# Altium schematic sheet JammerCon_v1.1.SchDoc
size 584 x 381 mm
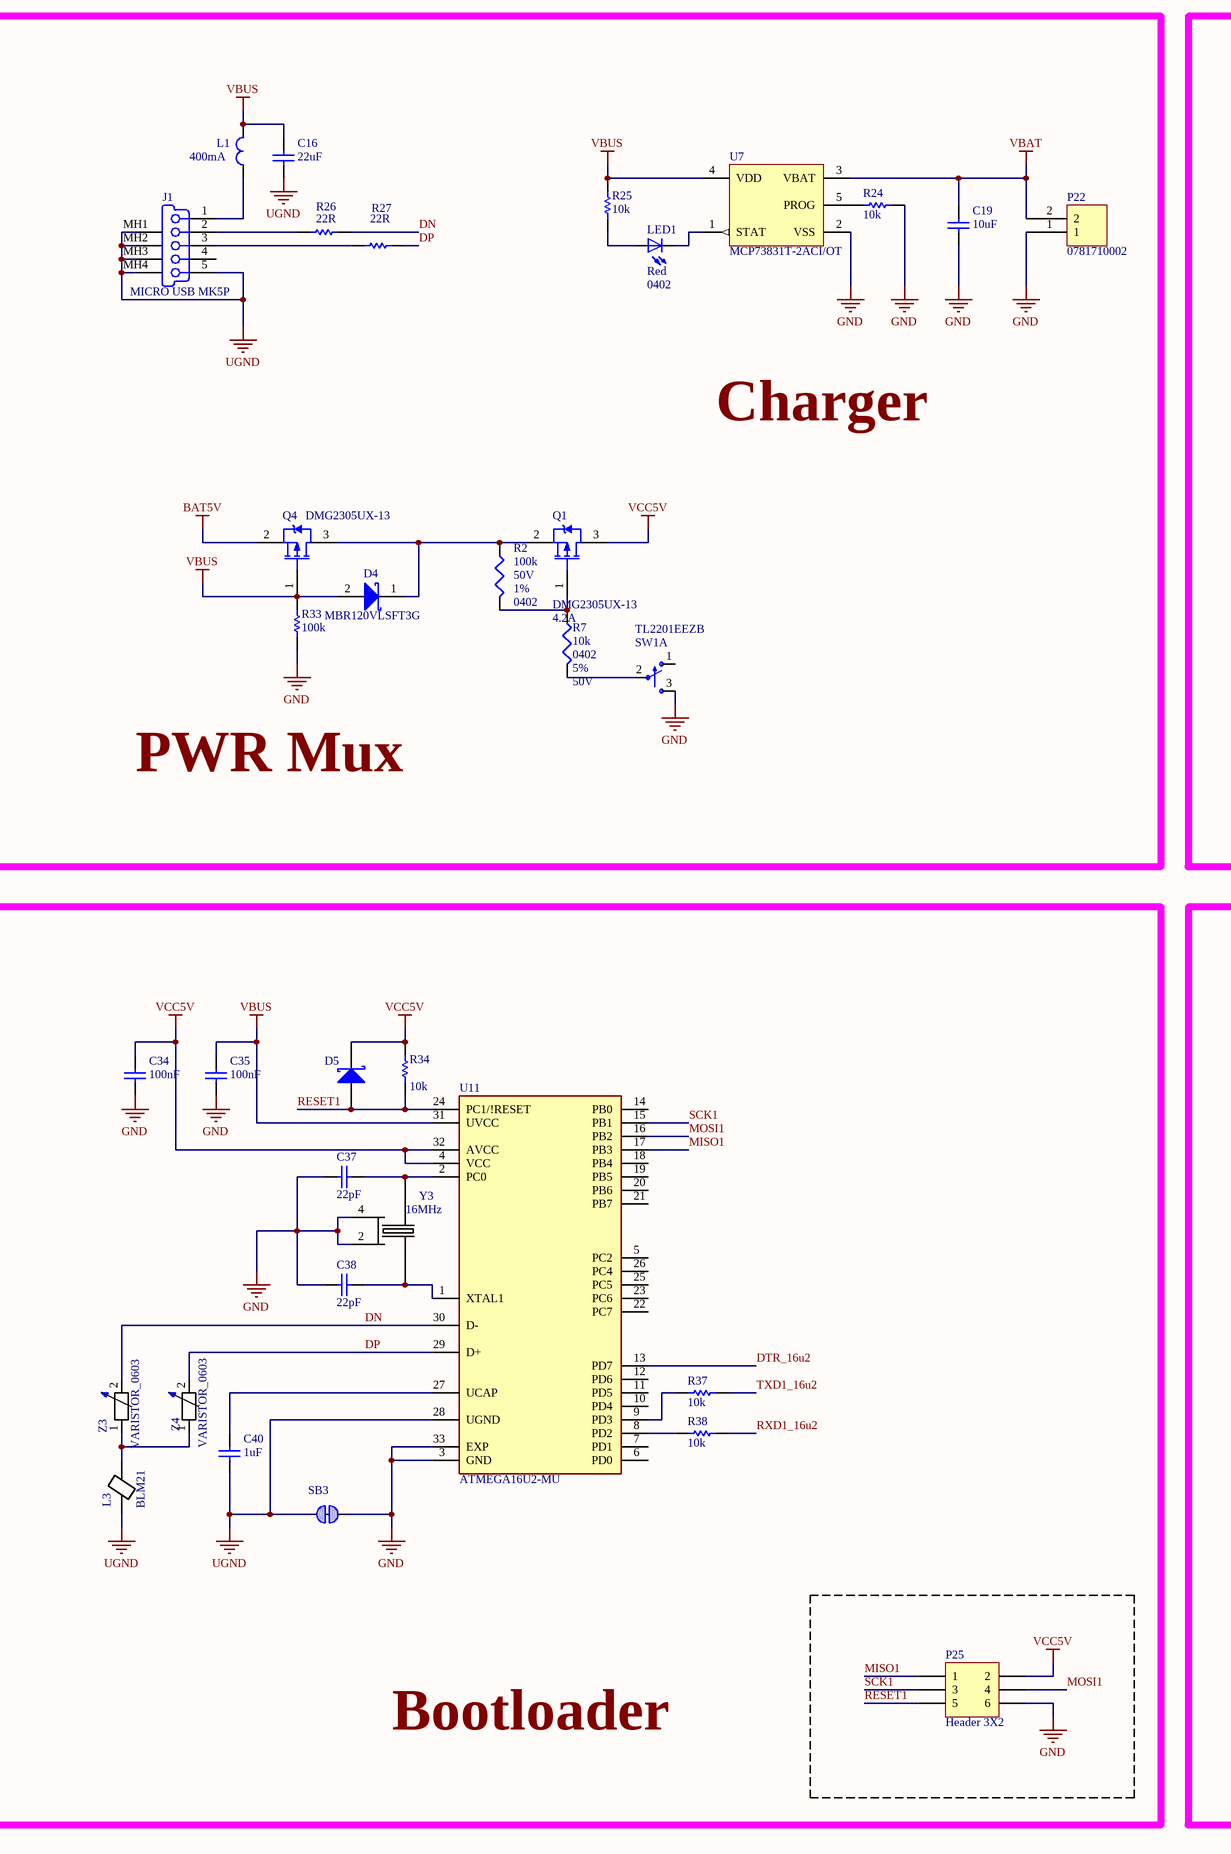
[diagram p0: JammerCon_v1.1.SchDoc, left]
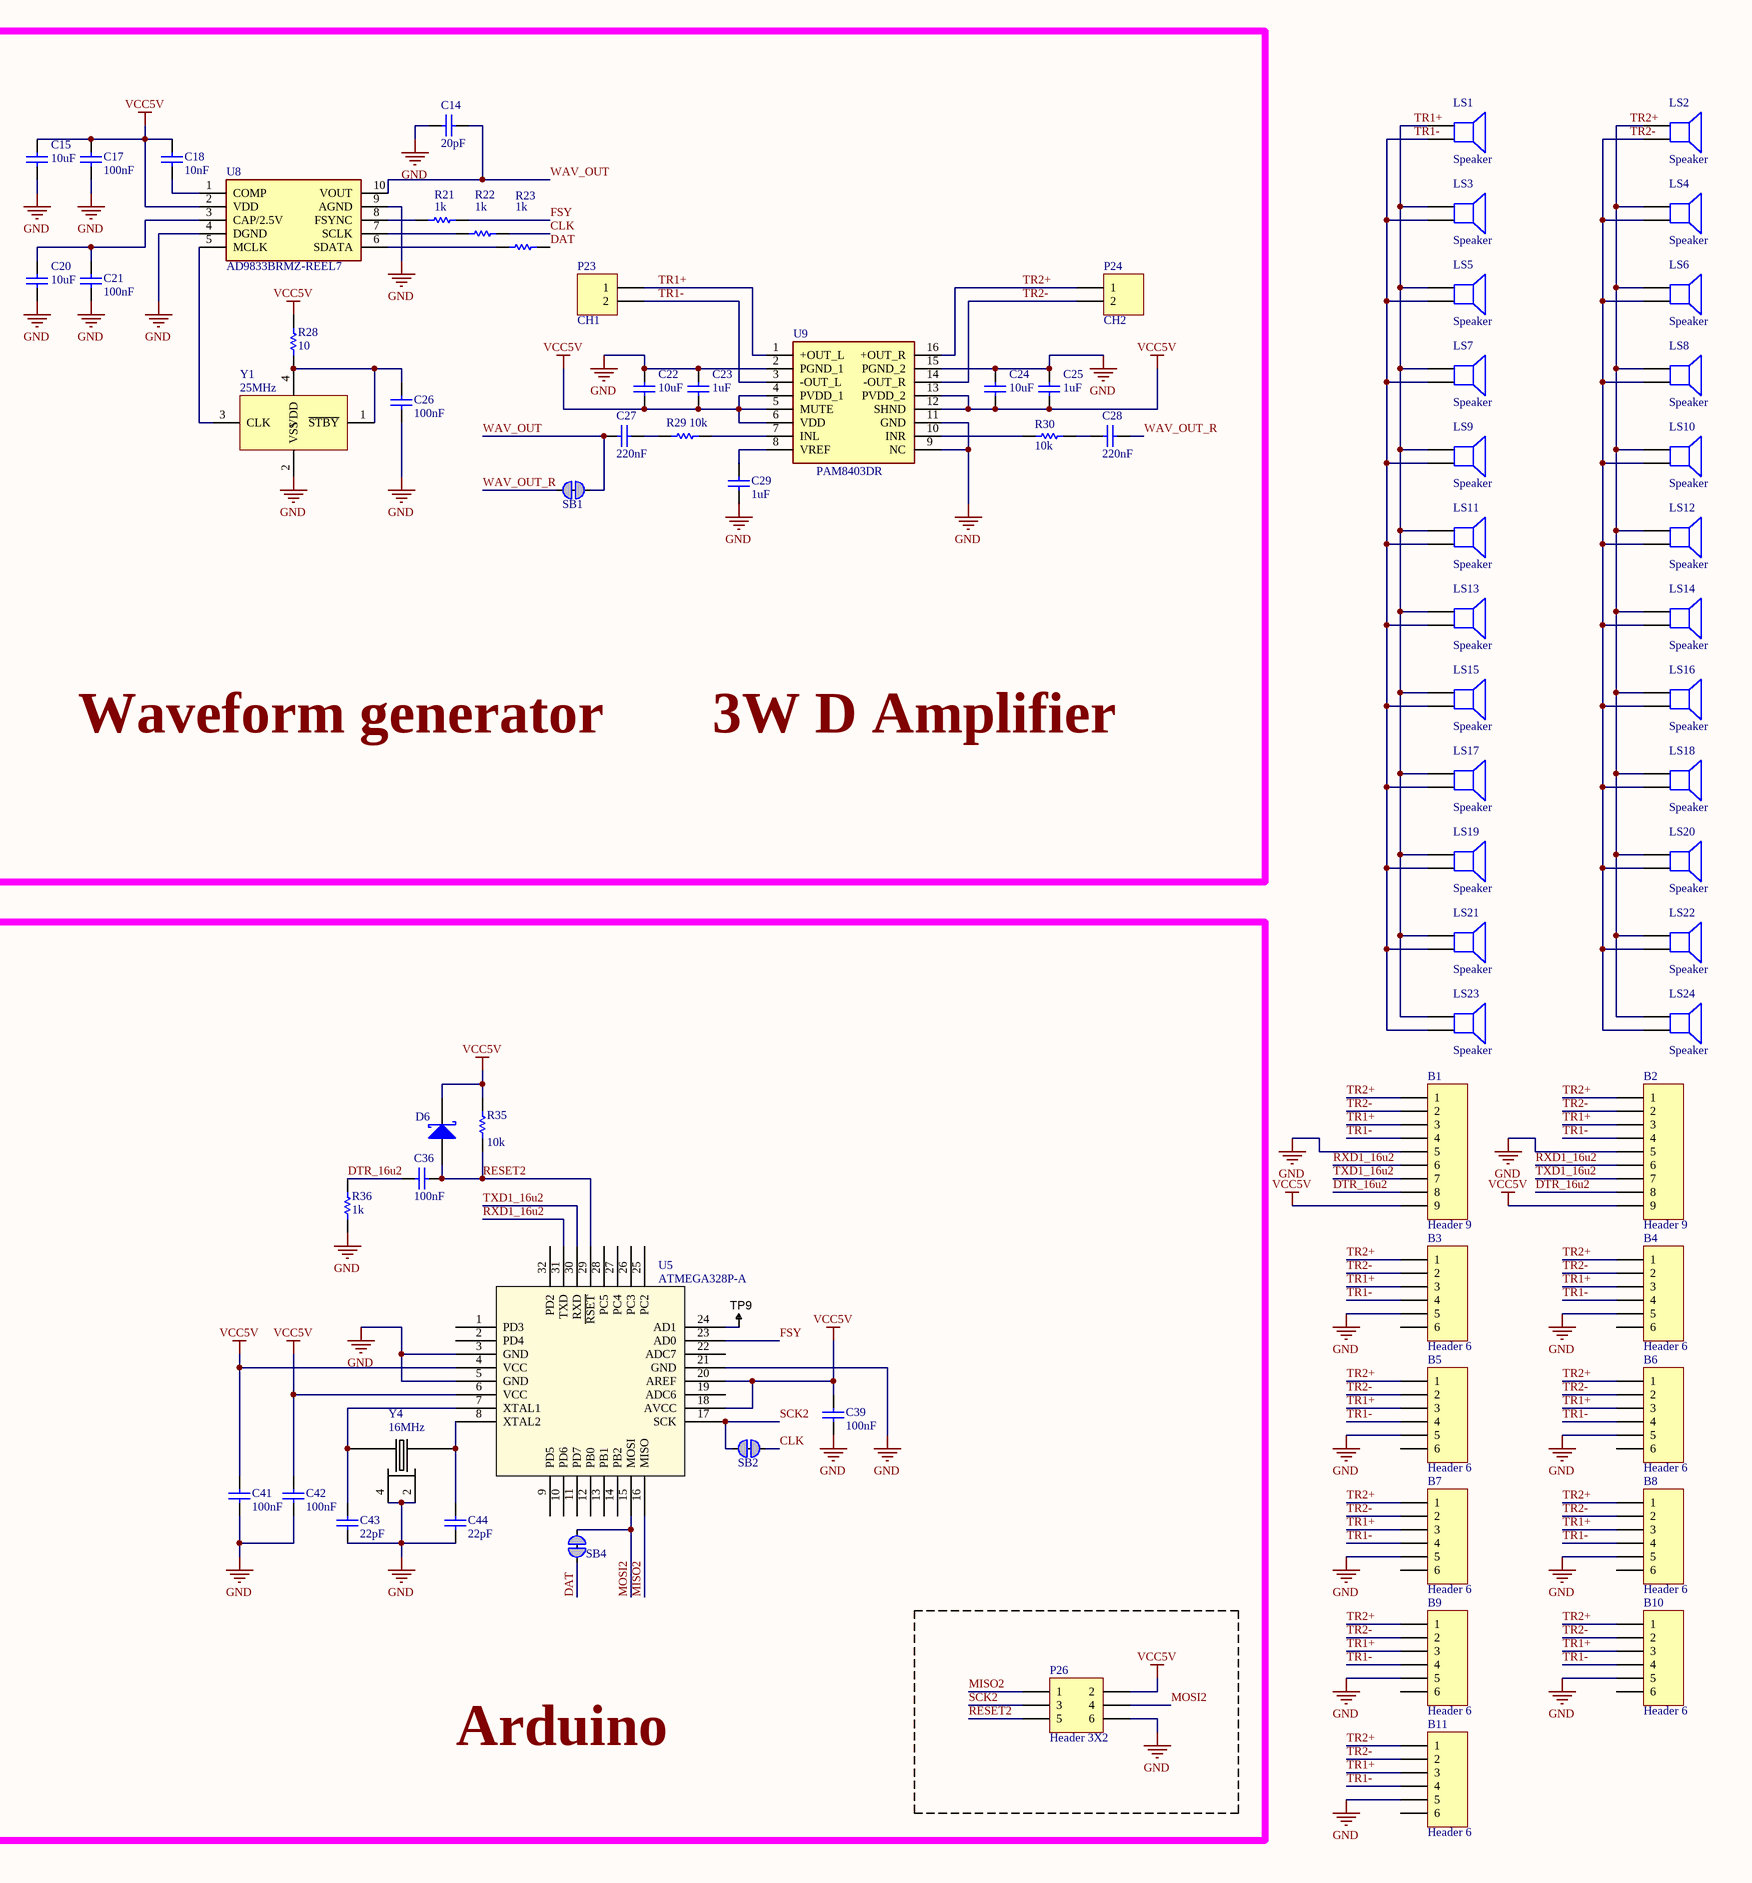
[diagram p1: JammerCon_v1.1.SchDoc, right]

## Parts
B1  Header 9  [HDR1X9]
B2  Header 9  [HDR1X9]
B3  Header 6  [HDR1X6]
B4  Header 6  [HDR1X6]
B5  Header 6  [HDR1X6]
B6  Header 6  [HDR1X6]
B7  Header 6  [HDR1X6]
B8  Header 6  [HDR1X6]
B9  Header 6  [HDR1X6]
B10  Header 6  [HDR1X6]
B11  Header 6  [HDR1X6]
C14  value 20pF  [C0402]  (hidden comment: Cap Semi)
C15  value 10uF  [C0805]  (hidden comment: Cap Semi)
C16  value 22uF  [C0603]  (hidden comment: Cap Semi)
C17  value 100nF  [R0402]  (hidden comment: Cap Semi)
C18  value 10nF  [R0402]  (hidden comment: Cap Semi)
C19  value 10uF  [C0402]  (hidden comment: Cap Semi)
C20  value 10uF  [C0805]  (hidden comment: Cap Semi)
C21  value 100nF  [R0402]  (hidden comment: Cap Semi)
C22  value 10uF  [C0603]  (hidden comment: Cap Semi)
C23  value 1uF  [C0603]  (hidden comment: Cap Semi)
C24  value 10uF  [C0603]  (hidden comment: Cap Semi)
C25  value 1uF  [C0603]  (hidden comment: Cap Semi)
C26  value 100nF  [R0402]  (hidden comment: Cap Semi)
C27  value 220nF  [C0603]  (hidden comment: Cap Semi)
C28  value 220nF  [C0603]  (hidden comment: Cap Semi)
C29  value 1uF  [R0402]  (hidden comment: Cap Semi)
C34  value 100nF  [C0201]  (hidden comment: Cap Semi)
C35  value 100nF  [C0201]  (hidden comment: Cap Semi)
C36  value 100nF  [R0402]  (hidden comment: Cap Semi)
C37  value 22pF  [C0402]  (hidden comment: Cap Semi)
C38  value 22pF  [C0402]  (hidden comment: Cap Semi)
C39  value 100nF  [R0402]  (hidden comment: Cap Semi)
C40  value 1uF  [C0402]  (hidden comment: Cap Semi)
C41  value 100nF  [R0402]  (hidden comment: Cap Semi)
C42  value 100nF  [R0402]  (hidden comment: Cap Semi)
C43  value 22pF  [C0402]  (hidden comment: Cap Semi)
C44  value 22pF  [C0402]  (hidden comment: Cap Semi)
D4  MBR120VLSFT3G  [SOD-123FL]
D5  ZENER 5.6V  [SOD-323]  (value not drawn)
D6  ZENER 5.6V  [SOD-323]  (value not drawn)
J1  MICRO USB MK5P  [1050170001]
L1  Max DC Current: 400mA  [L0603]  (hidden comment: BMB2A0430RS2)
L3  BLM21  [*BEADC2012X87N]
LED1  Color: Red  Case/Package: 0402  [LED-0402-RED]
LS1  Speaker  [ULTRASONICSENSOR]
LS2  Speaker  [ULTRASONICSENSOR]
LS3  Speaker  [ULTRASONICSENSOR]
LS4  Speaker  [ULTRASONICSENSOR]
LS5  Speaker  [ULTRASONICSENSOR]
LS6  Speaker  [ULTRASONICSENSOR]
LS7  Speaker  [ULTRASONICSENSOR]
LS8  Speaker  [ULTRASONICSENSOR]
LS9  Speaker  [ULTRASONICSENSOR]
LS10  Speaker  [ULTRASONICSENSOR]
LS11  Speaker  [ULTRASONICSENSOR]
LS12  Speaker  [ULTRASONICSENSOR]
LS13  Speaker  [ULTRASONICSENSOR]
LS14  Speaker  [ULTRASONICSENSOR]
LS15  Speaker  [ULTRASONICSENSOR]
LS16  Speaker  [ULTRASONICSENSOR]
LS17  Speaker  [ULTRASONICSENSOR]
LS18  Speaker  [ULTRASONICSENSOR]
LS19  Speaker  [ULTRASONICSENSOR]
LS20  Speaker  [ULTRASONICSENSOR]
LS21  Speaker  [ULTRASONICSENSOR]
LS22  Speaker  [ULTRASONICSENSOR]
LS23  Speaker  [ULTRASONICSENSOR]
LS24  Speaker  [ULTRASONICSENSOR]
P22  Manufacturer Part Number: 0781710002  [CONN_MOLEX_781710002]  (hidden comment: SMT Battery connector)
P23  CH1  [HDR1X2]
P24  CH2  [HDR1X2]
P25  Header 3X2  [TC2030-MCP]
P26  Header 3X2  [TC2030-MCP]
Q1  DMG2305UX-13  Continuous Drain Current (ID): 4.2A  [SOT23-3]
Q4  (no value)  [SOT23-3]
R2  value 100k  Case/Package: 0402  Tolerance: 1%  Voltage Rating: 50V  [R0402]  (hidden comment: Res3)
R7  value 10k  Case/Package: 0402  Tolerance: 5%  Voltage Rating: 50V  [R0402]  (hidden comment: Res3)
R21  value 1k  [R0402]  (hidden comment: Res0402)
R22  value 1k  [R0402]  (hidden comment: Res0402)
R23  value 1k  [R0402]  (hidden comment: Res0402)
R24  value 10k  [R0402]  (hidden comment: Res0402)
R25  value 10k  [R0402]  (hidden comment: Res0402)
R26  value 22R  [R0402]  (hidden comment: Res0402)
R27  value 22R  [R0402]  (hidden comment: Res0402)
R28  value 10  [R0402]  (hidden comment: Res0402)
R29  value 10k  [R0603]  (hidden comment: Res0402)
R30  value 10k  [R0603]  (hidden comment: Res0402)
R33  value 100k  [R0402]  (hidden comment: Res0402)
R34  value 10k  [R0402]  (hidden comment: Res0402)
R35  value 10k  [R0402]  (hidden comment: Res0402)
R36  value 1k  [R0402]  (hidden comment: Res)
R37  value 10k  [R0201]  (hidden comment: Res0201)
R38  value 10k  [R0201]  (hidden comment: Res0201)
SB1  Solderbridge  [Solderbridge_Shorted]  (value not drawn)  (net tie, no BOM)
SB2  Solderbridge  [Solderbridge_Shorted]  (value not drawn)  (net tie, no BOM)
SB3  Solderbridge  [Solderbridge_Shorted]  (value not drawn)  (net tie, no BOM)
SB4  Solderbridge  [Solderbridge_Shorted]  (value not drawn)  (net tie, no BOM)
SW1  TL2201EEZB  [TL2201EEZB]  (part A of 2)
TP9  TESTPOINT  [TP-R60]  (value not drawn)  (no BOM)
U5  ATMEGA328P-A  [ATMEGA328P]
U7  MCP73831T-2ACI/OT  [SOT23-5]
U8  AD9833BRMZ-REEL7  [SOP50P490X110-10N]
U9  PAM8403DR  [SOIC127P605X175-16N]
U11  ATMEGA16U2-MU  [*QFN50P500X500X100-33N]
Y1  25MHz  [OSC_ECS-3951M-250-BN-TR]
Y3  16MHz  [BT-XTAL_2016_N]
Y4  16MHz  [BT-XTAL_2016_N]
Z3  VARISTOR_0603  [*R0603]
Z4  VARISTOR_0603  [*R0603]

## Nets
BAT5V: Q4.2(S)
GND: B1.5 B2.5 B3.5 B4.5 B5.5 B6.5 B7.5 B8.5 B9.5 B10.5 B11.5 C14.1 C15.1 C17.2 C19.1 C20.1 C21.2 C22.2 C23.2 C24.2 C25.2 C26.2 C29.2 C34.1 C35.1 C37.2 C38.2 C39.1 C41.1 C42.1 C43.2 C44.2 P22.1 P25.6 P26.6 R24.2 R33.1 R36.1 SB3.2 SW1.3(S) U5.3(GND) U5.5(GND) U5.21(GND) U7.2(VSS) U8.4(DGND) U8.9(AGND) U9.2(PGND_1) U9.9(NC) U9.11(GND) U9.15(PGND_2) U11.3(GND) U11.33(EXP) Y1.2(VSS) Y3.2 Y3.4 Y4.2 Y4.4
UGND: C16.1 C40.1 J1.5(GND) J1.MH1(Tab) J1.MH2(Tab) J1.MH3(Tab) J1.MH4(Tab) L3.1 SB3.1 U11.28(UGND)
VBAT: C19.2 P22.2 U7.3(VBAT)
VBUS: C16.2 C35.2 D4.2(K) L1.2 Q4.1(G) R25.2 R33.2 U7.4(VDD) U11.31(UVCC)
VCC5V: B1.9 B2.9 C15.2 C17.1 C18.1 C22.1 C23.1 C24.1 C25.1 C34.2 C39.2 C41.2 C42.2 D5.2(K) D6.2(K) P25.2 P26.2 Q1.3(D) R28.1 R34.2 R35.2 U5.4(VCC) U5.6(VCC) U5.18(AVCC) U5.20(AREF) U8.2(VDD) U9.4(PVDD_1) U9.5(MUTE) U9.6(VDD) U9.12(SHND) U9.13(PVDD_2) U11.4(VCC) U11.32(AVCC)
CLK: R22.1 SB2.2
DAT: R23.1 SB4.2
DN: R26.1 U11.30(D-) Z3.2
DP: R27.1 U11.29(D+) Z4.2
DTR_16u2: B1.8 B2.8 C36.2 R36.2 U11.13(PD7)
FSY: R21.1 U5.23(AD0)
MISO1: P25.1 U11.17(PB3)
MISO2: P26.1 U5.16(MISO)
MOSI1: P25.4 U11.16(PB2)
MOSI2: P26.4 SB4.1 U5.15(MOSI)
RESET1: D5.1(A) P25.5 R34.1 U11.24(PC1/!RESET)
RESET2: C36.1 D6.1(A) P26.5 R35.1 U5.29(~{RSET})
RXD1_16u2: B1.6 B2.6 R38.2 U5.31(TXD)
SCK1: P25.3 U11.15(PB1)
SCK2: P26.3 SB2.1 U5.17(SCK)
TR1+: B1.3 B2.3 B3.3 B4.3 B5.3 B6.3 B7.3 B8.3 B9.3 B10.3 B11.3 LS1.1 LS3.1 LS5.1 LS7.1 LS9.1 LS11.1 LS13.1 LS15.1 LS17.1 LS19.1 LS21.1 LS23.1 P23.1 U9.1(+OUT_L)
TR1-: B1.4 B2.4 B3.4 B4.4 B5.4 B6.4 B7.4 B8.4 B9.4 B10.4 B11.4 LS1.2 LS3.2 LS5.2 LS7.2 LS9.2 LS11.2 LS13.2 LS15.2 LS17.2 LS19.2 LS21.2 LS23.2 P23.2 U9.3(-OUT_L)
TR2+: B1.1 B2.1 B3.1 B4.1 B5.1 B6.1 B7.1 B8.1 B9.1 B10.1 B11.1 LS2.1 LS4.1 LS6.1 LS8.1 LS10.1 LS12.1 LS14.1 LS16.1 LS18.1 LS20.1 LS22.1 LS24.1 P24.1 U9.16(+OUT_R)
TR2-: B1.2 B2.2 B3.2 B4.2 B5.2 B6.2 B7.2 B8.2 B9.2 B10.2 B11.2 LS2.2 LS4.2 LS6.2 LS8.2 LS10.2 LS12.2 LS14.2 LS16.2 LS18.2 LS20.2 LS22.2 LS24.2 P24.2 U9.14(-OUT_R)
TXD1_16u2: B1.7 B2.7 R37.2 U5.30(RXD)
WAV_OUT: C14.2 C27.2 SB1.2 U8.10(VOUT)
WAV_OUT_R: C28.2 SB1.1
NetC18_2: C18.2 U8.1(COMP)
NetC20_2: C20.2 C21.1 U8.3(CAP/2.5V)
NetC26_1: C26.1 R28.2 Y1.1(~{STBY}) Y1.4(VDD)
NetC27_1: C27.1 R29.2
NetC28_1: C28.1 R30.2
NetC29_1: C29.1 U9.8(VREF)
NetC37_1: C37.1 U11.2(PC0) Y3.1
NetC38_1: C38.1 U11.1(XTAL1) Y3.3
NetC40_2: C40.2 U11.27(UCAP)
NetC43_1: C43.1 U5.7(XTAL1) Y4.1
NetC44_1: C44.1 U5.8(XTAL2) Y4.3
NetD4_1: D4.1(A) Q1.2(S) Q4.3(D) R2.1
NetJ1_1: J1.1(V_BUS_(5V)) L1.1
NetJ1_2: J1.2(D-) R26.2
NetJ1_3: J1.3(D+) R27.2
NetL3_2: L3.2 Z3.1 Z4.1
NetLED1_A: LED1.A R25.1
NetLED1_C: LED1.C U7.1(STAT)
NetQ1_1: Q1.1(G) R2.2 R7.1
NetR7_2: R7.2 SW1.2(P)
NetR21_2: R21.2 U8.8(FSYNC)
NetR22_2: R22.2 U8.7(SCLK)
NetR23_2: R23.2 U8.6(SDATA)
NetR24_1: R24.1 U7.5(PROG)
NetR29_1: R29.1 U9.7(INL)
NetR30_1: R30.1 U9.10(INR)
NetR37_1: R37.1 U11.9(PD3)
NetR38_1: R38.1 U11.8(PD2)
NetTP9_1: TP9.1 U5.24(AD1)
NetU8_5: U8.5(MCLK) Y1.3(CLK)

Not connected (* = marked no-connect by the designer): B3 6; B4 6; B5 6; B6 6; B7 6; B8 6; B9 6; B10 6; B11 6; J1 4(NC); SW1 1(O); U5 1(PD3) 2(PD4) 9(PD5) 10(PD6) 11(PD7) 12(PB0) 13(PB1) 14(PB2) 19(ADC6) 22(ADC7) 25(PC2) 26(PC3) 27(PC4) 28(PC5) 32(PD2); U11 5(PC2) 6(PD0) 7(PD1) 10(PD4) 11(PD5) 12(PD6) 14(PB0) 18(PB4) 19(PB5) 20(PB6) 21(PB7) 22(PC7) 23(PC6) 25(PC5) 26(PC4)

## Notes on the sheet
- Charger
- Waveform generator
- 3W D Amplifier
- PWR Mux
- Bootloader
- Arduino

## Library data of the parts
B1 B2 = Header 9: Header, 9-Pin; LatestRevisionDate: 17-Jul-2002; LatestRevisionNote: Re-released for DXP Platform.; Publisher: Altium Limited
B3-B11 = Header 6: Header, 6-Pin; LatestRevisionDate: 17-Jul-2002; LatestRevisionNote: Re-released for DXP Platform.; Publisher: Altium Limited
C14-C29 C34-C44 = Cap Semi: Capacitor (Semiconductor SIM Model)
D4 = D Schottky: Schottky Diodes & Rectifiers 1A 20V; Manufacturer: ON Semiconductor; Max Surge Current: 45A; Forward Voltage: 340mV; Max Reverse Current: 600uA; Element Configuration: Single; Polarity: Standard; Supplier 1: Digi-Key; Supplier Part Number 1: MBR120VLSFT3GOSCT-ND; Manufacturer Part Number: MBR120VLSFT3G; Stock 1: 9969; Pricing 1: 1=0.41, 10=0.317, 100=0.1903, 500=0.1762, 1000=0.1198, 2000=0.1103, 5000=0.1057 (USD); Number of Pins: 2; Min Operating Temperature: -65°C; Max Operating Temperature: 125°C; Package Quantity: 10000; Forward Current: 1A; Packaging: Tape and Reel; Max Reverse Leakage Current: 600uA; Average Rectified Current: 1A; Peak Non-Repetitive Surge Current: 45A; Max Repetitive Reverse Voltage (Vrrm): 20V; Max Forward Surge Current (Ifsm): 45A; Voltage Rating (DC): 20V; Current Rating: 1A; Output Current: 1A; Max Reverse Voltage (DC): 20V; Series: -; Radiation Hardening: No; REACH SVHC: No SVHC; Lead Free: Lead Free; Halogen Free: Halogen Free; RoHS Compliant: Yes; ComponentLink1URL: http://www.mouser.com/ds/2/308/MBR120VLSFT1-D-107081.pdf?src-supplier=Mouser; ComponentLink1Description: http://www.mouser.com/ds/2/308/MBR120VLSFT1-D-107081.pdf?src-supplier=Mouser; ComponentLink2URL: http://www.onsemi.com/pub/Collateral/MBR120VLSFT1-D.PDF?src-supplier=Digi-Key; ComponentLink2Description: http://www.onsemi.com/pub/Collateral/MBR120VLSFT1-D.PDF?src-supplier=Digi-Key; ComponentLink3URL: http://www.onsemi.cn/pub_link/Collateral/MBR120VLSFT1-D.PDF?src-supplier=Avnet; ComponentLink3Description: http://www.onsemi.cn/pub_link/Collateral/MBR120VLSFT1-D.PDF?src-supplier=Avnet
D5 D6 = Diode 18TQ045: Zener Diode 5.6V SOD-323F; Manufacturer: ON Semiconductor / Fairchild; Manufacturer Part Number: MM3Z5V6B; Value: 5.6V 200mW; Max Power Dissipation: 200mW; Forward Voltage: 1V; Tolerance: 2%; Impedance: 37R; Max Reverse Leakage Current: 900nA; Test Current: 5mA; Element Configuration: Single; Supplier 1: Digi-Key; Supplier Part Number 1: MM3Z5V6BDKR-ND; Stock 1: 198832; Pricing 1: 1=0.22, 10=0.18, 100=0.0956, 500=0.0629, 1000=0.0428 (USD); Mount: Surface Mount; Number of Pins: 2; Weight: 0.0276g; Min Operating Temperature: -65°C; Max Operating Temperature: 150°C; Packaging: Tape and Reel; Package Quantity: 1; Zener Voltage: 5.6V; Voltage Tolerance: 2%; Power Dissipation: 200mW; Working Voltage: 5.6V; Peak Reverse Current: 900nA; Length: 1.3mm; Height: 1mm; Width: 1.7mm; Radiation Hardening: No; REACH SVHC: No SVHC; Lead Free: Lead Free; ComponentLink1URL: http://www.fairchildsemi.com/ds/MM/MM3Z9V1B.pdf; ComponentLink1Description: http://www.fairchildsemi.com/ds/MM/MM3Z9V1B.pdf; ComponentLink2URL: http://www.onsemi.com/pub/Collateral/MM3Z9V1B-D.pdf; ComponentLink2Description: http://www.onsemi.com/pub/Collateral/MM3Z9V1B-D.pdf; ComponentLink3URL: http://www.mouser.com/ds/2/149/MM3Z5V6B-195782.pdf; ComponentLink3Description: http://www.mouser.com/ds/2/149/MM3Z5V6B-195782.pdf
J1 = USB_Mini_B: USB On-The-Go (OTG) Mini-B
L1 = BEAD: FERRITE BEAD INDUCTOR; Manufacturer: Taiyo Yuden; Manufacturer Part Number: BK1608HW431-T; Tolerance: 25%; Impedance: 430R; Resistance: 300mR; Number of Lines: 1; Test Frequency: 100MHz; Shielding: Shielded; Supplier 1: Digi-Key; Supplier Part Number 1: 587-1878-1-ND; Stock 1: 5299; Pricing 1: 1=0.1, 10=0.079, 25=0.072, 50=0.0648, 100=0.0476, 250=0.0346, 500=0.0317, 1000=0.0274 (USD); Mount: Surface Mount; Case/Package: 0603; Number of Pins: 2; Core Material: Ferrite; Case Code (Metric): 1608; Case Code (Imperial): 0603; Min Operating Temperature: -55°C; Max Operating Temperature: 125°C; Package Quantity: 1; Packaging: Tape and Reel; Max Current Rating: 400mA; DC Resistance (DCR): 300mR; Termination: SMD/SMT; Frequency: 100MHz; Length: 0.063inch; Height: 0.037inch; Width: 0.031inch; Depth: 0.95mm; REACH SVHC: No SVHC; Lead Free: Lead Free; Halogen Free: Halogen Free; ComponentLink1URL: http://ds.yuden.co.jp/TYCOMPAS/ut/detail.do?productNo=BK1608HW431-T&fileName=BK1608HW431-T_SS&mode=specSheetDownload&src-supplier=Digi-Key; ComponentLink1Description: http://ds.yuden.co.jp/TYCOMPAS/ut/detail.do?productNo=BK1608HW431-T&fileName=BK1608HW431-T_SS&mode=specSheetDownload&src-supplier=Digi-Key; ComponentLink2URL: http://www.yuden.co.jp/productdata/catalog/en/mlci07_e.pdf?src-supplier=Farnell; ComponentLink2Description: http://www.yuden.co.jp/productdata/catalog/en/mlci07_e.pdf?src-supplier=Farnell; ComponentLink3URL: http://www.farnell.com/datasheets/2083103.pdf?src-supplier=Element14; ComponentLink3Description: http://www.farnell.com/datasheets/2083103.pdf?src-supplier=Element14
L3 = BLM21PG331SN1D: Ferrite Beads Multi-Layer 330Ohm 25% 100MHz 1.5A 70mOhm DCR 0805 Paper T/R; MF: Murata; MP: BLM21PG331SN1D; SnapEDA_Link: https://www.snapeda.com/parts/BLM21PG331SN1D/Murata%20Electronics%20North%20America/view-part/?ref=snap; Availability: Unavailable; Package: 0805 Murata; Price: None; Value: *
LED1 = LED0402 red: Red LED 0402; Manufacturer: SunLED; Manufacturer Part Number: XZMDK68W-2; Lens Color: Colorless; Lens Transparency: Clear; Luminous Intensity: 69mcd; Test Current: 20mA; Viewing Angle: 120°; Dominant Wavelength: 630nm; Forward Voltage: 1.95V; Supplier 1: Digi-Key; Supplier Part Number 1: 1497-1174-1-ND; Stock 1: 195016; Pricing 1: 1=0.32, 10=0.249, 100=0.1117, 500=0.1009, 1000=0.0829 (USD); Mount: Surface Mount; Case Code (Metric): 1005; Case Code (Imperial): 0402; Packaging: Tape and Reel; Length: 1mm; Width: 0.5mm; Height: 0.6mm; RoHS Compliant: Yes; ComponentLink1URL: http://www.sunledusa.com/products/spec/XZMDK68W-2.pdf?src-supplier=Digi-Key; ComponentLink1Description: http://www.sunledusa.com/products/spec/XZMDK68W-2.pdf?src-supplier=Digi-Key; ComponentLink2URL: https://www.sunledusa.com/products/spec/XZMDK68W-2.pdf?src-supplier=Digi-Key; ComponentLink2Description: https://www.sunledusa.com/products/spec/XZMDK68W-2.pdf?src-supplier=Digi-Key
LS1-LS24 = Speaker: Loudspeaker
  LS2-LS24: Published: 24-Mar-1999; LatestRevisionDate: 17-Jul-2002; LatestRevisionNote: Re-released for DXP Platform.; PackageReference: PIN2; Publisher: Altium Limited
P22 = CONN_MOLEX_0781710002: 1.20MM WTB HEADER VERT 2POS; Manufacturer: Molex; Number of Positions: 2; Max Voltage Rating (DC): 50V; Contact Resistance: 20mR; Connector Type: Tab,Plug; Pitch: 1.2mm; Supplier 1: Digi-Key; Supplier Part Number 1: WM4459CT-ND; Stock 1: 35198; Pricing 1: 1=0.61, 10=0.567, 100=0.4349, 500=0.3782, 1000=0.312 (USD); Mount: Surface Mount; Housing Material: Polymer; Color: Black; Contact Plating: Gold; Contact Material: Copper Alloy; Housing Color: Black; Min Operating Temperature: -25°C; Max Operating Temperature: 85°C; Number of Rows: 1; Packaging: Tape and Reel; Termination: Solder; Orientation: Straight; Fastening Type: Friction; Max Voltage Rating (AC): 50V; Number of Contacts: 2; Length: 4.2mm; Depth: 4.5mm; Radiation Hardening: No; ComponentLink1URL: https://www.molex.com/pdm_docs/as/AS-78172-006-001.pdf?src-supplier=Digi-Key; ComponentLink1Description: https://www.molex.com/pdm_docs/as/AS-78172-006-001.pdf?src-supplier=Digi-Key; ComponentLink2URL: http://components.arrow.com/part/dataview/47501414S8822330N3303?src-supplier=Arrow; ComponentLink2Description: http://components.arrow.com/part/dataview/47501414S8822330N3303?src-supplier=Arrow; ComponentLink3URL: https://www.molex.com/pdm_docs/sd/781710002_sd.pdf?src-supplier=Digi-Key; ComponentLink3Description: https://www.molex.com/pdm_docs/sd/781710002_sd.pdf?src-supplier=Digi-Key; ComponentLink4URL: http://www.molex.com/webdocs/datasheets/pdf/en-us/0781710002_PCB_HEADERS.pdf?src-supplier=Avnet; ComponentLink4Description: http://www.molex.com/webdocs/datasheets/pdf/en-us/0781710002_PCB_HEADERS.pdf?src-supplier=Avnet
P23 P24 = Header 2: Header, 2-Pin; LatestRevisionDate: 17-Jul-2002; LatestRevisionNote: Re-released for DXP Platform.; Publisher: Altium Limited
P25 P26 = Header 3X2: Header, 3-Pin, Dual row
Q1 = ZXMP10A13FTA: MOSFET P-CH 20V 4.2A SOT23; Manufacturer: Diodes; Rise Time: 13.7ns; Rds On Max: 52mR; Input Capacitance: 808pF; Max Power Dissipation: 1.4W; Turn-On Delay Time: 10.8ns; Turn-Off Delay Time: 79.3ns; Fall Time: 34.7ns; Threshold Voltage: -900mV; Element Configuration: Single; Gate to Source Voltage (Vgs): 8V; Number of Channels: 1; Drain to Source Breakdown Voltage: -20V; On-State Resistance: 65MR; Supplier 1: Digi-Key; Supplier Part Number 1: DMG2305UX-13DICT-ND; Manufacturer Part Number: DMG2305UX-13; Stock 1: 562398; Pricing 1: 1=0.38, 10=0.348, 100=0.1948, 500=0.1044, 1000=0.071 (EUR); Mount: Surface Mount; Case/Package: SOT-23; Number of Pins: 3; Weight: 0.000282oz; Min Operating Temperature: -55°C; Max Operating Temperature: 150°C; Package Quantity: 1; Packaging: Tape and Reel; Drain to Source Voltage (Vdss): 20V; Drain to Source Resistance: 52mR; Length: 3mm; Height: 1.1mm; Width: 1.4mm; Radiation Hardening: No; REACH SVHC: No SVHC; Lead Free: Lead Free; ComponentLink1URL: http://www.diodes.com/datasheets/DMG2305UX.pdf; ComponentLink1Description: http://www.diodes.com/datasheets/DMG2305UX.pdf; ComponentLink2URL: https://www.diodes.com/assets/Datasheets/DMG2305UX.pdf; ComponentLink2Description: https://www.diodes.com/assets/Datasheets/DMG2305UX.pdf
Q4 = DMG2305UX-13: MOSFET P-CH 20V 4.2A SOT23; Manufacturer: Diodes; Rise Time: 13.7ns; Rds On Max: 52mR; Input Capacitance: 808pF; Max Power Dissipation: 1.4W; Turn-On Delay Time: 10.8ns; Turn-Off Delay Time: 79.3ns; Fall Time: 34.7ns; Threshold Voltage: -900mV; Element Configuration: Single; Gate to Source Voltage (Vgs): 8V; Number of Channels: 1; Drain to Source Breakdown Voltage: -20V; On-State Resistance: 65MR; Supplier 1: Digi-Key; Supplier Part Number 1: DMG2305UX-13DICT-ND; Manufacturer Part Number: DMG2305UX-13; Stock 1: 1009768; Pricing 1: 1=0.37, 10=0.253, 25=0.2528, 100=0.1236, 500=0.1031, 1000=0.0717, 2500=0.0621, 5000=0.059 (USD); Mount: Surface Mount; Case/Package: SOT-23; Number of Pins: 3; Weight: 0.000282oz; Min Operating Temperature: -55°C; Max Operating Temperature: 150°C; Package Quantity: 1; Packaging: Tape and Reel; Continuous Drain Current (ID): 4.2A; Drain to Source Voltage (Vdss): 20V; Drain to Source Resistance: 52mR; Length: 3mm; Width: 1.4mm; Height: 1.1mm; Radiation Hardening: No; REACH SVHC: No SVHC; Lead Free: Lead Free; RoHS Compliant: Yes; ComponentLink1URL: http://www.diodes.com/datasheets/DMG2305UX.pdf?src-supplier=Avnet; ComponentLink1Description: http://www.diodes.com/datasheets/DMG2305UX.pdf?src-supplier=Avnet; ComponentLink2URL: https://www.diodes.com/assets/Datasheets/DMG2305UX.pdf?src-supplier=Digi-Key; ComponentLink2Description: https://www.diodes.com/assets/Datasheets/DMG2305UX.pdf?src-supplier=Digi-Key; ComponentLink3URL: http://www.diodes.com/datasheets/DMG2305UX.pdf?src-supplier=Future+Electronics; ComponentLink3Description: http://www.diodes.com/datasheets/DMG2305UX.pdf?src-supplier=Future+Electronics
R2 = Res3: Resistor; Manufacturer: Yageo; Manufacturer Part Number: RC0402FR-07100KL; Resistance: 100kR; Temperature Coefficient: 100ppm/°C; Power Rating: 63mW; Supplier 1: Digi-Key; Supplier Part Number 1: 311-100KLRCT-ND; Stock 1: 62177550; Pricing 1: 1=0.1, 10=0.016, 100=0.0067, 1000=0.003, 2500=0.0026, 5000=0.0022 (USD); Case Code (Metric): 1005; Case Code (Imperial): 0402; Min Operating Temperature: -55°C; Max Operating Temperature: 155°C; Packaging: Tape and Reel; Composition: Thick Film; Termination: SMD/SMT; Military Standard: Not; Number of Terminations: 2; Working Voltage: 50V; Package Quantity: 1; Max Power Dissipation: 63mW; Features: Moisture Resistant; Length: 0.039inch; Height: 0.016inch; Width: 0.02inch; Depth: 0.5mm; REACH SVHC: No SVHC; Lead Free: Lead Free; ComponentLink1URL: http://www.yageo.com/documents/recent/PYu-RC_Group_51_RoHS_L_10.pdf?src-supplier=Digi-Key; ComponentLink1Description: http://www.yageo.com/documents/recent/PYu-RC_Group_51_RoHS_L_10.pdf?src-supplier=Digi-Key; ComponentLink2URL: http://www.farnell.com/datasheets/1018594.pdf?src-supplier=Element14; ComponentLink2Description: http://www.farnell.com/datasheets/1018594.pdf?src-supplier=Element14; ComponentLink3URL: http://www.yageo.com/documents/recent/PYu-RC_Group_51_RoHS_L_9.pdf?src-supplier=Verical; ComponentLink3Description: http://www.yageo.com/documents/recent/PYu-RC_Group_51_RoHS_L_9.pdf?src-supplier=Verical; ComponentLink4URL: http://www.yageo.com/documents/recent/PYu-RC_Group_51_RoHS_L_9.pdf?src-supplier=Mouser; ComponentLink4Description: http://www.yageo.com/documents/recent/PYu-RC_Group_51_RoHS_L_9.pdf?src-supplier=Mouser; ComponentLink5URL: http://documents.rs-components.com/techlib://itc_doclist_GB.htm?stockno=6185797&src-supplier=RSComponents; ComponentLink5Description: http://documents.rs-components.com/techlib://itc_doclist_GB.htm?stockno=6185797&src-supplier=RSComponents
R7 = Res3: Resistor; Manufacturer: TE Connectivity; Manufacturer Part Number: CRG0402J10K/10; Resistance: 10kR; Temperature Coefficient: 200ppm/°C; Power Rating: 63mW; Number of Resistors: 1; Supplier 1: Digi-Key; Supplier Part Number 1: 311-10KJRCT-ND; Supplier 2: Digi-Key; Supplier Part Number 2: A106045CT-ND; Stock 2: 164304; Pricing 2: 1=0.1, 10=0.016, 100=0.0064, 1000=0.0029, 2500=0.0025, 5000=0.0021 (USD); Mount: Surface Mount; Weight: 2.3E-05oz; Case Code (Imperial): 0402; Case Code (Metric): 1005; Min Operating Temperature: -55°C; Max Operating Temperature: 125°C; Packaging: Tape and Reel; Composition: Thick Film; Package Quantity: 10000; Number of Terminations: 2; Termination: Solder; Voltage Rating (DC): 50V; Length: 1mm; Height: 0.35mm; Width: 0.5mm; Depth: 0.5mm; Radiation Hardening: No; REACH SVHC: Unknown; ELV: Compliant; ComponentLink1URL: http://uk.rs-online.com/webdocs/13e2/0900766b813e23cb.pdf; ComponentLink1Description: http://uk.rs-online.com/webdocs/13e2/0900766b813e23cb.pdf; ComponentLink2URL: http://www.farnell.com/datasheets/1610603.pdf; ComponentLink2Description: http://www.farnell.com/datasheets/1610603.pdf; ComponentLink3URL: http://www.mouser.com/ds/2/418/NG_CD_1622826_BA1-677535.pdf; ComponentLink3Description: http://www.mouser.com/ds/2/418/NG_CD_1622826_BA1-677535.pdf; ComponentLink4URL: http://www.te.com/commerce/DocumentDelivery/DDEController?Action=showdoc&DocId=Data+Sheet%7F1773204%7FF%7Fpdf%7FEnglish%7FENG_DS_1773204_F.pdf; ComponentLink4Description: http://www.te.com/commerce/DocumentDelivery/DDEController?Action=showdoc&DocId=Data+Sheet%7F1773204%7FF%7Fpdf%7FEnglish%7FENG_DS_1773204_F.pdf
R21-R23 R26-R30 R34 R35 = Res0402: Semiconductor Resistor
R24 R25 R33 R36-R38 = Res0201: Semiconductor Resistor
SB1-SB4 = SOLDERBRIDGE_SHORTED: Shorted Solderbridge; Value: Solderbridge
SW1 = TL2201EEZB: Pushbutton Switch DPDT Standard Through Hole; MF: E-Switch; Purchase-URL: https://pricing.snapeda.com/search/part/TL2201EEZB/?ref=eda; MP: TL2201EEZB; Value: *; Availability: Good; Check_prices: https://www.snapeda.com/parts/TL2201EEZB/E-Switch/view-part/5162943/?ref=eda; SnapEDA_Link: https://www.snapeda.com/parts/TL2201EEZB/E-Switch/view-part/5162943/?ref=snap; Price: None; Package: None
TP9 = TESTPOINT: SMD test pin
U5 = ATMEGA328P-A: IC, SWITCH, SPDT ANA, SMD; Manufacturer: Microchip / Atmel; Manufacturer Part Number: ATMEGA328PB-AUR; Frequency: 20MHz; Interface: I2C,SPI,UART,USART; Number of I/Os: 27; Oscillator Type: Internal; RAM Size: 2KB; Number of Timers/Counters: 5; Watchdog Timer: Yes; Memory Type: FLASH; Memory Size: 32KB; Peripherals: Brown-out Detect/Reset,POR,PWM,WDT; Min Supply Voltage: 1.8V; Max Supply Voltage: 5.5V; Core Architecture: AVR; Operating Supply Voltage: 5V; Supplier 1: Digi-Key; Supplier Part Number 1: ATMEGA328PB-AURCT-ND; Stock 1: 11340; Pricing 1: 1=1.46, 25=1.3392, 100=1.2154 (USD); Mount: Surface Mount; Case/Package: TQFP; Number of Pins: 32; Contact Plating: Matte,Tin; Min Operating Temperature: -40°C; Max Operating Temperature: 85°C; Packaging: Tape and Reel; Number of Programmable I/O: 27; Max Frequency: 20MHz
U7 = MCP73831T-2ACI/OT_1: IC CONTROLLR LI-ION 4.2V SOT23-5; Manufacturer: Microchip Technology; Battery Chemistry: Lithium-Ion/Polymer; Number of Cells: 1; Current - Charging: Constant - Programmable; Programmable Features: Current; Fault Protection: Over Voltage; Charge Current - Max: 500mA; Voltage - Supply (Max): 6V; Supplier 1: Digi-Key; Supplier Part Number 1: MCP73831T-2ACI/OTCT-ND; Manufacturer Part Number: MCP73831T-2ACI/OT; RoHS: RoHS Compliant; Category: Integrated Circuits (ICs); Stock 1: 18101; Pricing 1: 1=0.58, 25=0.484, 100=0.4326 (USD); Packaging: Cut Tape (CT); Part Status: Active; Battery Pack Voltage: 4.2V; Interface: -; Operating Temperature: -40°C ~ 85°C (TA); Package / Case: SC-74A, SOT-753; Supplier Device Package: SOT-23-5; ComponentLink1URL: http://www.microchip.com/mymicrochip/filehandler.aspx?ddocname=en025112; ComponentLink1Description: http://www.microchip.com/mymicrochip/filehandler.aspx?ddocname=en025112
U8 = AD9833BRMZ-REEL7: Integrated Circuit; Manufacturer_Name: Analog Devices; Datasheet Link: https://www.analog.com/media/en/technical-documentation/data-sheets/ad9833.pdf; Height: 1.1mm; Manufacturer_Part_Number: AD9833BRMZ-REEL7; Mouser Part Number: 584-AD9833BRMZ-R7; Mouser Price/Stock: https://www.mouser.co.uk/ProductDetail/Analog-Devices/AD9833BRMZ-REEL7?qs=BpaRKvA4VqGlyZCX2gCZvQ%3D%3D; Arrow Part Number: AD9833BRMZ-REEL7; Arrow Price/Stock: https://www.arrow.com/en/products/ad9833brmz-reel7/analog-devices
U9 = PAM8403DR: Fuse; Manufacturer_Name: LITTELFUSE; Datasheet Link: https://pdf1.alldatasheet.com/datasheet-pdf/view/1132029/DIODES/PAM8403.html; Height: 1.75mm; Manufacturer_Part_Number: PAM8403DR; Mouser Part Number: N/A; Mouser Price/Stock: https://www.mouser.com/Search/Refine.aspx?Keyword=N%2FA
U11 = ATMEGA16U2-MU: Integrated Circuit; Manufacturer_Name: Microchip; Datasheet Link: http://ww1.microchip.com/downloads/en/DeviceDoc/doc7799.pdf; Height: 1mm; Manufacturer_Part_Number: ATMEGA16U2-MU; Mouser Part Number: 556-ATMEGA16U2-MU; Mouser Price/Stock: https://www.mouser.co.uk/ProductDetail/Microchip-Technology-Atmel/ATMEGA16U2-MU/?qs=JV7lzlMm3yIZlyznMyuPNA%3D%3D; Arrow Part Number: ATMEGA16U2-MU; Arrow Price/Stock: https://www.arrow.com/en/products/atmega16u2-mu/microchip-technology
Y1 = ECS-3951M-250-BN-TR: XTAL OSC XO 25.0000MHZ CMOS SMD; Manufacturer: ECS International; Load Capacitance: 30pF; Operating Supply Voltage: 5V; Max Supply Voltage: 5.5V; Min Supply Voltage: 4.5V; Max Supply Current: 20mA; Frequency Stability: 50ppm; Supplier 1: Digi-Key; Manufacturer Part Number: ECS-3951M-250-BN-TR; Stock 1: 1359; Pricing 1: 1=4.08, 10=3.885, 50=3.6908, 100=3.3022, 500=3.108 (USD); Mount: Surface Mount; Case/Package: SMD/SMT; Min Operating Temperature: -40°C; Max Operating Temperature: 85°C; Package Quantity: 1; Frequency: 25MHz; Packaging: Tape and Reel; Termination: SMD/SMT; Series: ECS-3951M-BN; Length: 0.276inch; Width: 0.197inch; Height: 0.067inch; Lead Free: Lead Free; RoHS Compliant: Yes; ComponentLink1URL: http://www.ecsxtal.com/store/pdf/ecs-3951m-bn-3953m-bn.pdf?src-supplier=Digi-Key; ComponentLink1Description: http://www.ecsxtal.com/store/pdf/ecs-3951m-bn-3953m-bn.pdf?src-supplier=Digi-Key; Supplier Part Number 1: XC321CT-ND
Y3 Y4 = 416F32022CKR: Crystal 32MHz; Supplier 1: Digi-Key; Value: 16MHz
  Y4: Supplier Part Number 1: CTX1410CT-ND
Z3 Z4 = SMD-RES-VARISTOR-5V-28V(0603): Varistor, ESD Clamp Protector, 5 VDC, 20 Vclamp, IEC 61000-4-2 Level 4, 0603 SMD; MP: CG0603MLC-05E; MF: Bourns; SnapEDA_Link: https://www.snapeda.com/parts/CG0603MLC-05E/Bourns%20-%20J.W.%20Miller/view-part/?ref=snap; Availability: Unavailable; Price: None; Package: 0603 Bourns; Value: *